# EAGLE schematic Root_ESP_v1.0 (EAGLE 7.6.0)
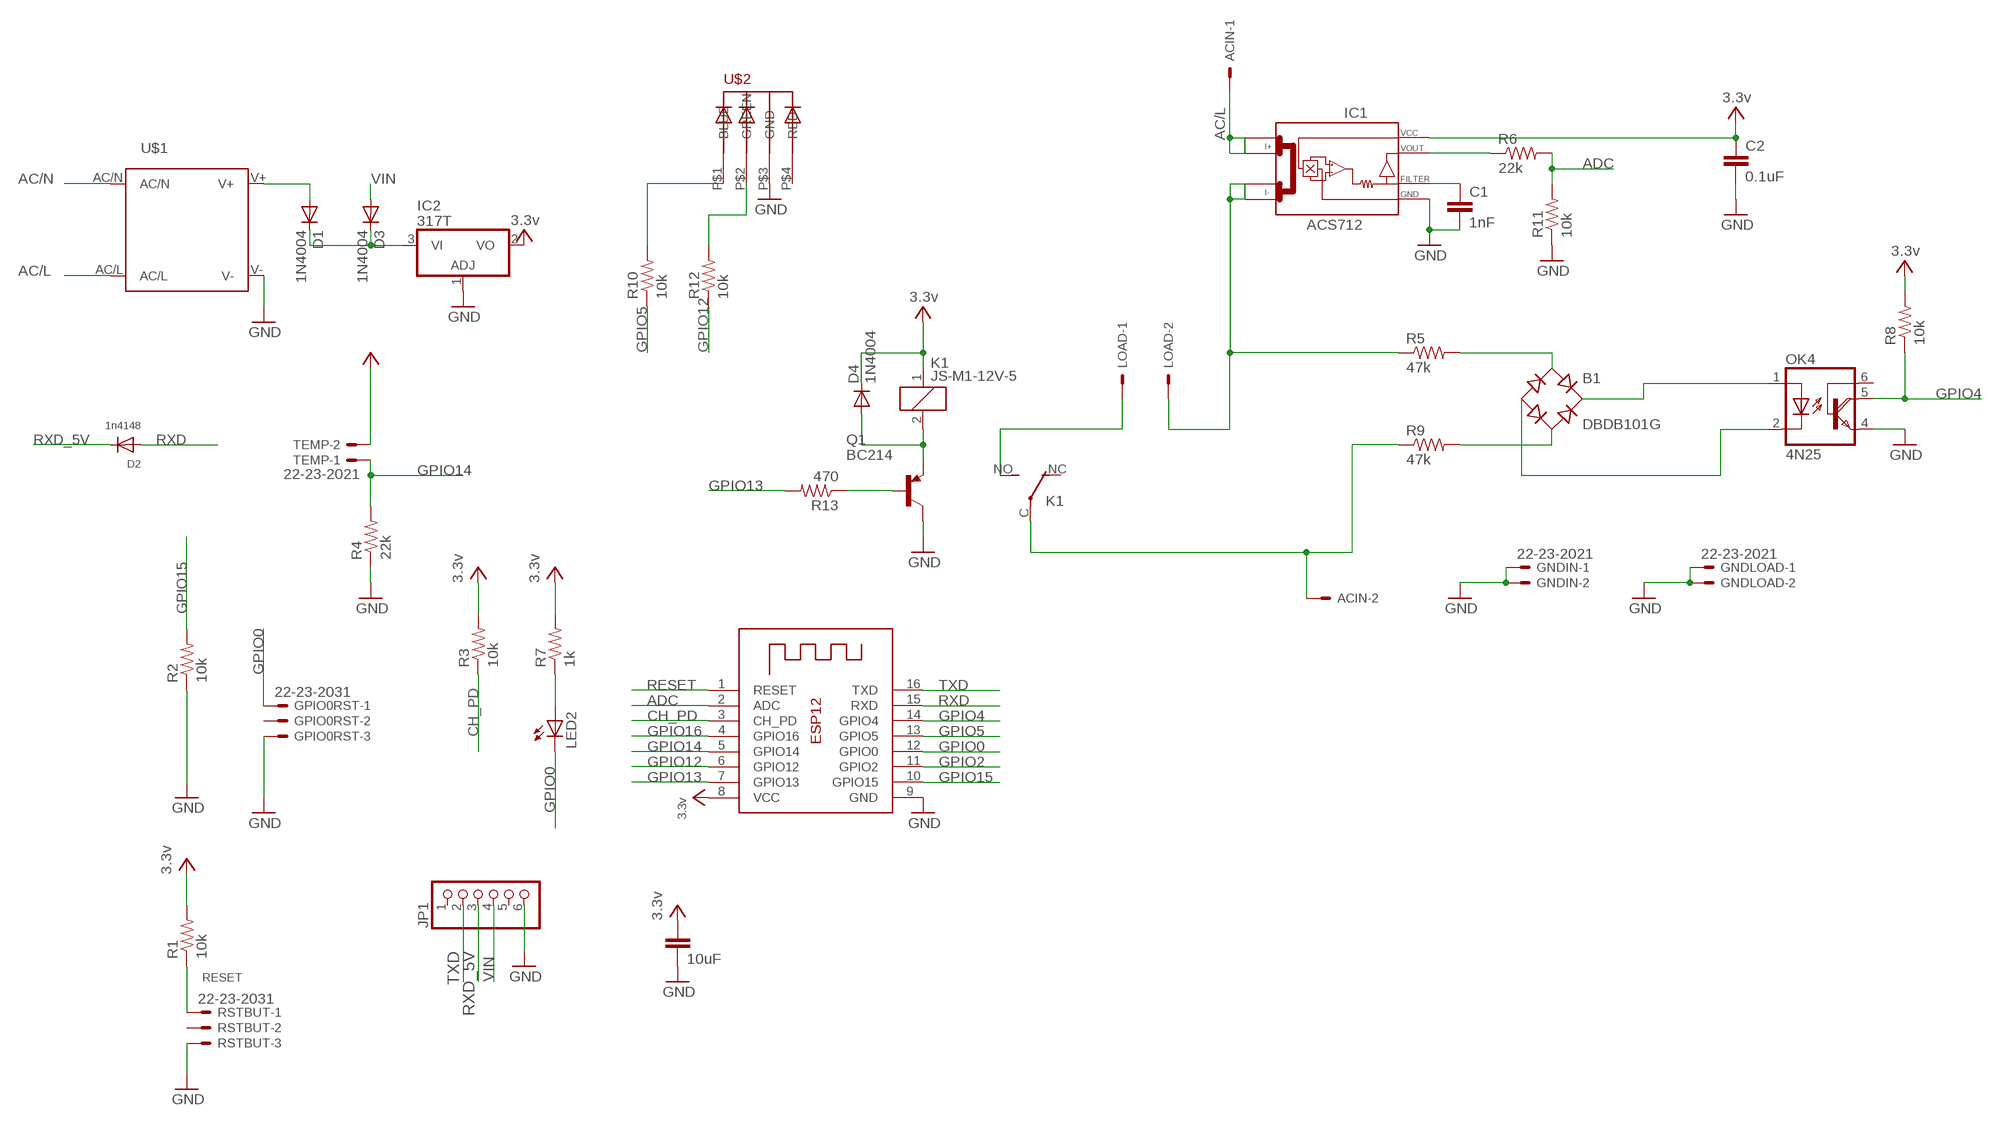
[diagram p0: schematic, sheet 1]

## Parts
ACIN  22-23-2021  [22-23-2021]
B1  DBDB101G  [DB]
C1  1nF  C5/2.5  [C5B2.5]
C2  0.1uF  C5/2.5  [C5B2.5]
C3  10uF  C5/3  [C5B3]
D1  1N4004  [DO41-10]
D2  1n4148  DIODEDO-1N4148  [DO-1N4148]
D3  1N4004  [DO41-10]
D4  1N4004  [DO41-10]
GNDIN  22-23-2021  [22-23-2021]
GNDLOAD  22-23-2021  [22-23-2021]
GPIO0RST  22-23-2031  [22-23-2031]
IC1  ACS712  [SO08]
IC2  317T  [TO220H]
JP1  PINHD-1X6-3.5MM  [1X06-3.5MM]
K1  JS-M1-12V-5  [JS-M]
LED2  LED5MM  [LED5MM]
LOAD  22-23-2021  [22-23-2021]
OK4  4N25  [DIL06]
Q1  BC214  [TO92]
R1  10k  R-US_0204/7  [0204/7]
R2  10k  R-US_0204/7  [0204/7]
R3  10k  R-US_0204/7  [0204/7]
R4  22k  R-US_0204/7  [0204/7]
R5  47k  R-US_0204/7  [0204/7]
R6  22k  R-US_0204/7  [0204/7]
R7  1k  R-US_0204/7  [0204/7]
R8  10k  R-US_0204/7  [0204/7]
R9  47k  R-US_0204/7  [0204/7]
R10  10k  R-US_0204/7  [0204/7]
R11  10k  R-US_0204/7  [0204/7]
R12  10k  R-US_0204/7  [0204/7]
R13  470  R-US_0204/7  [0204/7]
RSTBUT  22-23-2031  [22-23-2031]
TEMP  22-23-2021  [22-23-2021]
U$1  IRM_03IRM_03  [IRM_03]
U$2  5MMRGBLED  [LED5MMRGB]
X1  ESP-12  [ESP-12]

## Nets
AC/L: ACIN.1 IC1.1(I+_0) IC1.2(I+_1) U$1.AC/L
AC/N: ACIN.2 K1.C(2:P) R9.1 U$1.AC/N
ADC: R6.2 R11.2 X1.2(ADC)
CH_PD: R3.1 X1.3(CH_PD)
GND: C1.2 C2.2 C3.2 GNDIN.1 GNDIN.2 GNDLOAD.1 GNDLOAD.2 GPIO0RST.3 IC1.5(GND) IC2.1(ADJ) JP1.6 OK4.4(E) Q1.3(C) R2.1 R4.1 R11.1 RSTBUT.3 U$1.V- U$2.P$3(GND) X1.9(GND)
GPIO0: GPIO0RST.1 LED2.K(C) X1.12(GPIO0)
GPIO2: X1.11(GPIO2)
GPIO4: OK4.5(COL) R8.1 X1.14(GPIO4)
GPIO5: R10.1 X1.13(GPIO5)
GPIO12: R12.1 X1.6(GPIO12)
GPIO13: R13.2 X1.7(GPIO13)
GPIO14: R4.2 TEMP.1 X1.5(GPIO14)
GPIO15: R2.2 X1.10(GPIO15)
GPIO16: X1.4(GPIO16)
LOAD/L: IC1.3(I-_0) IC1.4(I-_1) LOAD.2 R5.1
LOAD/N: K1.NO(2:S) LOAD.1
N$1: B1.AC1 R5.2
N$2: C1.1 IC1.6(FILTER)
N$3: B1.AC2 R9.2
N$4: B1.+ OK4.1(A)
N$5: B1.- OK4.2(C)
N$6: LED2.A R7.1
N$7: IC1.7(VOUT) R6.1
N$8: D4.A K1.2 Q1.1(E)
N$9: D1.A U$1.V+
N$10: R10.2 U$2.P$1(BLUE)
N$11: R12.2 U$2.P$2(GREEN)
N$12: D1.C D3.C IC2.3(VI)
N$13: Q1.2(B) R13.1
RESET: R1.1 RSTBUT.1 X1.1(RESET)
RXD: D2.A X1.15(RXD)
RXD_5V: D2.C JP1.3
TXD: JP1.2 X1.16(TXD)
VCC: C2.1 C3.1 D4.C IC1.8(VCC) IC2.2(VO) K1.1 R1.2 R3.2 R7.2 R8.2 TEMP.2 X1.8(VCC) ; supply symbol labelled 3.3v
VIN: D3.A JP1.4
Unconnected: GPIO0RST.2 JP1.1 JP1.5 K1.NC(2:O) OK4.6(B) RSTBUT.2 U$2.P$4(RED)

## Library data of the parts
ACIN GNDIN GNDLOAD LOAD TEMP = con-molex:22-23-2021: .100" (2.54mm) Center Header - 2 Pin; MF: MOLEX; MPN: 22-23-2021; OC_FARNELL: 1462926; OC_NEWARK: 25C3832
B1 = rectifier:DB?*G: Single Phase 1.0 AMP Glass Passivated Bridge Rectifier Taiwan Semiconductor Co.,Ltd. - TSC Source: http://www.taiwansemi.com/TSCbig5/ezcatfiles/cust/img/img/db101g.pdf http://www.ts.com.tw/db/pictures/modules/PDT/PDT060207001/DBLS201G.pdf
C1 C2 = capacitor-wima:C: CAPACITOR naming: grid - package width
C3 = capacitor-wima:C: CAPACITOR naming: grid - package width; C5: 0.1uF
D1 D3 D4 = diode:1N4004: DIODE general purpose rectifier, 1 A
D2 = adafruit:DIODE: Diode SMADIODE - SMA Surface Mount Package 20V 1A Schottky Diode Digikey: 641-1014-6-ND DO-1N4148 - Through Hole Small Current Diode SOD-123 20V 1 A (.5mV Vf) Schottky Diode - Digikey: MBRX120TPMSCT-ND SOD-323 10V 570mA (.38mV Vf, 3ns) Schottky Diode - Digikey: ZLLS410CT-ND SOD-523 30V 30mA Schottky Diode (RB751S-40TE61) - Digikey: RB751S-40TE61CT-ND SOT23-R/W - SOT23 Package (R = Solder Paste/Reflow Ovens, W = Hand-Soldering) BAT54Film 40V 300mA - Digikey: 497-7162-1-ND
GPIO0RST RSTBUT = con-molex:22-23-2031: .100" (2.54mm) Center Header - 3 Pin; MF: MOLEX; MPN: 22-23-2031; OC_FARNELL: 1462950; OC_NEWARK: 30C0862
IC1 = ACS712:ACS712
IC2 = linear:*317: Positive VOLTAGE REGULATOR
JP1 = adafruit:PINHD-1X6: PIN HEADER
K1 = relay:JS-M1*: Automotive Ultra-Miniature Power Relay NAiS Source: http://www.mew-europe.com/.. en_ds_61211_0000.pdf; MF: FARNELL; MPN: JSM1-12V-5; OC_FARNELL: 910351; OC_NEWARK: 14J1764
LED2 = adafruit:LED: LED OSRAM: - CHIPLED LG R971, LG N971, LY N971, LG Q971, LY Q971, LO R971, LY R971 LH N974, LH R974 LS Q976, LO Q976, LY Q976 LO Q996 - Hyper CHIPLED LW Q18S LB Q993, LB Q99A, LB R99A - SideLED LS A670, LO A670, LY A670, LG A670, LP A670 LB A673, LV A673, LT A673, LW A673 LH A674 LY A675 LS A676, LA A676, LO A676, LY A676, LW A676 LS A679, LY A679, LG A679 - Hyper Micro SIDELED® LS Y876, LA Y876, LO Y876, LY Y876 LT Y87S - SmartLED LW L88C, LW L88S LB L89C, LB L89S, LG L890 LS L89K, LO L89K, LY L89K LS L896, LA L896, LO L896, LY L896 - TOPLED LS T670, LO T670, LY T670, LG T670, LP T670 LSG T670, LSP T670, LSY T670, LOP T670, LYG T670 LG T671, LOG T671, LSG T671 LB T673, LV T673, LT T673, LW T673 LH T674 LS T676, LA T676, LO T676, LY T676, LB T676, LH T676, LSB T676, LW T676 LB T67C, LV T67C, LT T67C, LS T67K, LO T67K, LY T67K, LW E67C LS E67B, LA E67B, LO E67B, LY E67B, LB E67C, LV E67C, LT E67C LW T67C LS T679, LY T679, LG T679 LS T770, LO T770, LY T770, LG T770, LP T770 LB T773, LV T773, LT T773, LW T773 LH T774 LS E675, LA E675, LY E675, LS T675 LS T776, LA T776, LO T776, LY T776, LB T776 LHGB T686 LT T68C, LB T68C - Hyper Mini TOPLED® LB M676 - Mini TOPLED Santana® LG M470 LS M47K, LO M47K, LY M47K Source: http://www.osram.convergy.de/
OK4 = 4N25:4N25: Optocoupler, Phototransistor Output, With Base Connection VISHAY SEMICONDUCTORS created by Peter.Hofmann@ph-tronic.de <mailto:Reter.Hofmann@ph-tronic.de> 01-2006 Rev.0
Q1 = transistor-pnp:BC214: PNP Transistor
R1-R13 = rcl:R-US_: RESISTOR, American symbol
U$1 = meanwell_irm_v7:IRM_03: 3 watt IRM 03 Vout [V] Imax [A] Pmax [W] Eff [%] 3.3 0.9 3 68 5 0.6 3 72 9 0.33 3 77 12 0.25 3 78 15 0.2 3 78 24 0.125 3 80
U$2 = led_rgb:5MMRGBLED
X1 = adafruit:ESP-12